# Altium schematic sheet TCA_LP_FILTER.SchDoc: My title
size A3; Organization: University of California; Address1: 475 Portola Plaza; Address2: Los Angeles, CA 90095; Revision: R01; SheetNumber: 1; SheetTotal: 1
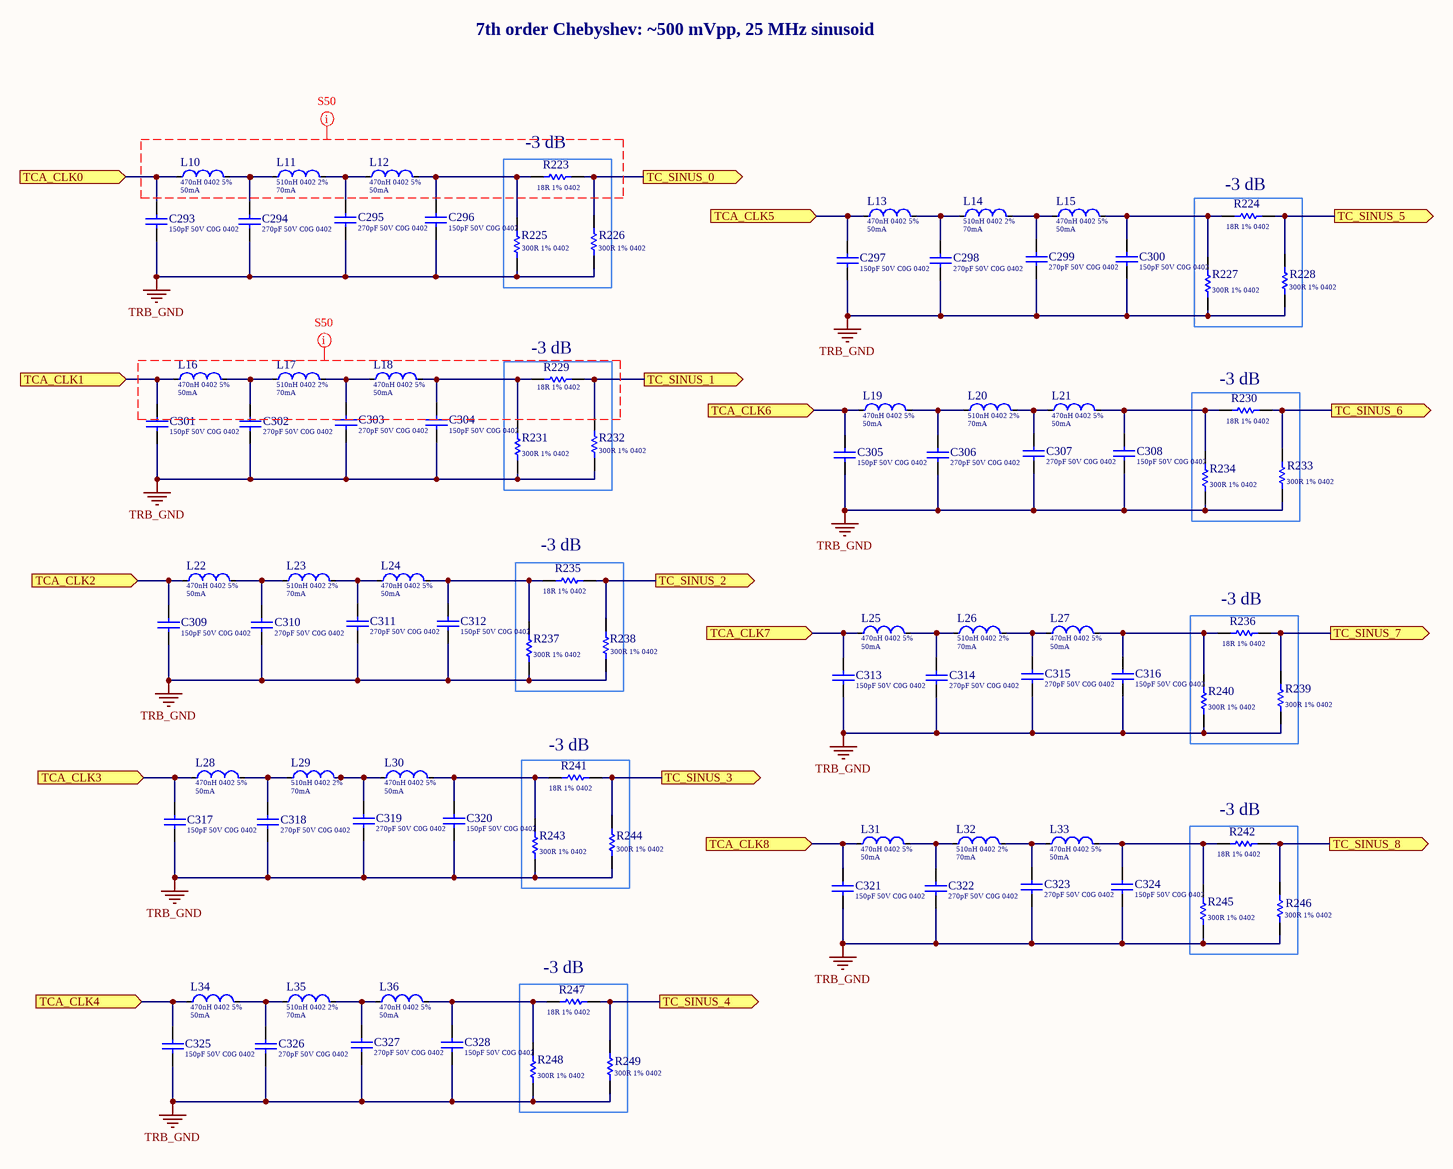
[diagram p0: TCA_LP_FILTER.SchDoc]

## Parts
C293  Capacitance: 150pF 50V C0G 0402  [Cap_TDK_CGA2B2C0G2A151J050BE_150pF]  (hidden comment: Cap_TDK_CGA2B2C0G2A151J050BE_150pF)
C294  Capacitance: 270pF 50V C0G 0402  [Cap_Murata_GCM1555C1H271FA16D_270pF]  (hidden comment: Cap_Murata_GCM1555C1H271FA16D_270pF)
C295  Capacitance: 270pF 50V C0G 0402  [Cap_Murata_GCM1555C1H271FA16D_270pF]  (hidden comment: Cap_Murata_GCM1555C1H271FA16D_270pF)
C296  Capacitance: 150pF 50V C0G 0402  [Cap_TDK_CGA2B2C0G2A151J050BE_150pF]  (hidden comment: Cap_TDK_CGA2B2C0G2A151J050BE_150pF)
C297  Capacitance: 150pF 50V C0G 0402  [Cap_TDK_CGA2B2C0G2A151J050BE_150pF]  (hidden comment: Cap_TDK_CGA2B2C0G2A151J050BE_150pF)
C298  Capacitance: 270pF 50V C0G 0402  [Cap_Murata_GCM1555C1H271FA16D_270pF]  (hidden comment: Cap_Murata_GCM1555C1H271FA16D_270pF)
C299  Capacitance: 270pF 50V C0G 0402  [Cap_Murata_GCM1555C1H271FA16D_270pF]  (hidden comment: Cap_Murata_GCM1555C1H271FA16D_270pF)
C300  Capacitance: 150pF 50V C0G 0402  [Cap_TDK_CGA2B2C0G2A151J050BE_150pF]  (hidden comment: Cap_TDK_CGA2B2C0G2A151J050BE_150pF)
C301  Capacitance: 150pF 50V C0G 0402  [Cap_TDK_CGA2B2C0G2A151J050BE_150pF]  (hidden comment: Cap_TDK_CGA2B2C0G2A151J050BE_150pF)
C302  Capacitance: 270pF 50V C0G 0402  [Cap_Murata_GCM1555C1H271FA16D_270pF]  (hidden comment: Cap_Murata_GCM1555C1H271FA16D_270pF)
C303  Capacitance: 270pF 50V C0G 0402  [Cap_Murata_GCM1555C1H271FA16D_270pF]  (hidden comment: Cap_Murata_GCM1555C1H271FA16D_270pF)
C304  Capacitance: 150pF 50V C0G 0402  [Cap_TDK_CGA2B2C0G2A151J050BE_150pF]  (hidden comment: Cap_TDK_CGA2B2C0G2A151J050BE_150pF)
C305  Capacitance: 150pF 50V C0G 0402  [Cap_TDK_CGA2B2C0G2A151J050BE_150pF]  (hidden comment: Cap_TDK_CGA2B2C0G2A151J050BE_150pF)
C306  Capacitance: 270pF 50V C0G 0402  [Cap_Murata_GCM1555C1H271FA16D_270pF]  (hidden comment: Cap_Murata_GCM1555C1H271FA16D_270pF)
C307  Capacitance: 270pF 50V C0G 0402  [Cap_Murata_GCM1555C1H271FA16D_270pF]  (hidden comment: Cap_Murata_GCM1555C1H271FA16D_270pF)
C308  Capacitance: 150pF 50V C0G 0402  [Cap_TDK_CGA2B2C0G2A151J050BE_150pF]  (hidden comment: Cap_TDK_CGA2B2C0G2A151J050BE_150pF)
C309  Capacitance: 150pF 50V C0G 0402  [Cap_TDK_CGA2B2C0G2A151J050BE_150pF]  (hidden comment: Cap_TDK_CGA2B2C0G2A151J050BE_150pF)
C310  Capacitance: 270pF 50V C0G 0402  [Cap_Murata_GCM1555C1H271FA16D_270pF]  (hidden comment: Cap_Murata_GCM1555C1H271FA16D_270pF)
C311  Capacitance: 270pF 50V C0G 0402  [Cap_Murata_GCM1555C1H271FA16D_270pF]  (hidden comment: Cap_Murata_GCM1555C1H271FA16D_270pF)
C312  Capacitance: 150pF 50V C0G 0402  [Cap_TDK_CGA2B2C0G2A151J050BE_150pF]  (hidden comment: Cap_TDK_CGA2B2C0G2A151J050BE_150pF)
C313  Capacitance: 150pF 50V C0G 0402  [Cap_TDK_CGA2B2C0G2A151J050BE_150pF]  (hidden comment: Cap_TDK_CGA2B2C0G2A151J050BE_150pF)
C314  Capacitance: 270pF 50V C0G 0402  [Cap_Murata_GCM1555C1H271FA16D_270pF]  (hidden comment: Cap_Murata_GCM1555C1H271FA16D_270pF)
C315  Capacitance: 270pF 50V C0G 0402  [Cap_Murata_GCM1555C1H271FA16D_270pF]  (hidden comment: Cap_Murata_GCM1555C1H271FA16D_270pF)
C316  Capacitance: 150pF 50V C0G 0402  [Cap_TDK_CGA2B2C0G2A151J050BE_150pF]  (hidden comment: Cap_TDK_CGA2B2C0G2A151J050BE_150pF)
C317  Capacitance: 150pF 50V C0G 0402  [Cap_TDK_CGA2B2C0G2A151J050BE_150pF]  (hidden comment: Cap_TDK_CGA2B2C0G2A151J050BE_150pF)
C318  Capacitance: 270pF 50V C0G 0402  [Cap_Murata_GCM1555C1H271FA16D_270pF]  (hidden comment: Cap_Murata_GCM1555C1H271FA16D_270pF)
C319  Capacitance: 270pF 50V C0G 0402  [Cap_Murata_GCM1555C1H271FA16D_270pF]  (hidden comment: Cap_Murata_GCM1555C1H271FA16D_270pF)
C320  Capacitance: 150pF 50V C0G 0402  [Cap_TDK_CGA2B2C0G2A151J050BE_150pF]  (hidden comment: Cap_TDK_CGA2B2C0G2A151J050BE_150pF)
C321  Capacitance: 150pF 50V C0G 0402  [Cap_TDK_CGA2B2C0G2A151J050BE_150pF]  (hidden comment: Cap_TDK_CGA2B2C0G2A151J050BE_150pF)
C322  Capacitance: 270pF 50V C0G 0402  [Cap_Murata_GCM1555C1H271FA16D_270pF]  (hidden comment: Cap_Murata_GCM1555C1H271FA16D_270pF)
C323  Capacitance: 270pF 50V C0G 0402  [Cap_Murata_GCM1555C1H271FA16D_270pF]  (hidden comment: Cap_Murata_GCM1555C1H271FA16D_270pF)
C324  Capacitance: 150pF 50V C0G 0402  [Cap_TDK_CGA2B2C0G2A151J050BE_150pF]  (hidden comment: Cap_TDK_CGA2B2C0G2A151J050BE_150pF)
C325  Capacitance: 150pF 50V C0G 0402  [Cap_TDK_CGA2B2C0G2A151J050BE_150pF]  (hidden comment: Cap_TDK_CGA2B2C0G2A151J050BE_150pF)
C326  Capacitance: 270pF 50V C0G 0402  [Cap_Murata_GCM1555C1H271FA16D_270pF]  (hidden comment: Cap_Murata_GCM1555C1H271FA16D_270pF)
C327  Capacitance: 270pF 50V C0G 0402  [Cap_Murata_GCM1555C1H271FA16D_270pF]  (hidden comment: Cap_Murata_GCM1555C1H271FA16D_270pF)
C328  Capacitance: 150pF 50V C0G 0402  [Cap_TDK_CGA2B2C0G2A151J050BE_150pF]  (hidden comment: Cap_TDK_CGA2B2C0G2A151J050BE_150pF)
L10  470nH 0402 5%  Current Rating: 50mA  [TDK_MLF1005GR47JT000_0]
L11  510nH 0402 2%  Current Rating: 70mA  [TDK_MHQ1005PR51GT000_0]
L12  470nH 0402 5%  Current Rating: 50mA  [TDK_MLF1005GR47JT000_0]
L13  470nH 0402 5%  Current Rating: 50mA  [TDK_MLF1005GR47JT000_0]
L14  510nH 0402 2%  Current Rating: 70mA  [TDK_MHQ1005PR51GT000_0]
L15  470nH 0402 5%  Current Rating: 50mA  [TDK_MLF1005GR47JT000_0]
L16  470nH 0402 5%  Current Rating: 50mA  [TDK_MLF1005GR47JT000_0]
L17  510nH 0402 2%  Current Rating: 70mA  [TDK_MHQ1005PR51GT000_0]
L18  470nH 0402 5%  Current Rating: 50mA  [TDK_MLF1005GR47JT000_0]
L19  470nH 0402 5%  Current Rating: 50mA  [TDK_MLF1005GR47JT000_0]
L20  510nH 0402 2%  Current Rating: 70mA  [TDK_MHQ1005PR51GT000_0]
L21  470nH 0402 5%  Current Rating: 50mA  [TDK_MLF1005GR47JT000_0]
L22  470nH 0402 5%  Current Rating: 50mA  [TDK_MLF1005GR47JT000_0]
L23  510nH 0402 2%  Current Rating: 70mA  [TDK_MHQ1005PR51GT000_0]
L24  470nH 0402 5%  Current Rating: 50mA  [TDK_MLF1005GR47JT000_0]
L25  470nH 0402 5%  Current Rating: 50mA  [TDK_MLF1005GR47JT000_0]
L26  510nH 0402 2%  Current Rating: 70mA  [TDK_MHQ1005PR51GT000_0]
L27  470nH 0402 5%  Current Rating: 50mA  [TDK_MLF1005GR47JT000_0]
L28  470nH 0402 5%  Current Rating: 50mA  [TDK_MLF1005GR47JT000_0]
L29  510nH 0402 2%  Current Rating: 70mA  [TDK_MHQ1005PR51GT000_0]
L30  470nH 0402 5%  Current Rating: 50mA  [TDK_MLF1005GR47JT000_0]
L31  470nH 0402 5%  Current Rating: 50mA  [TDK_MLF1005GR47JT000_0]
L32  510nH 0402 2%  Current Rating: 70mA  [TDK_MHQ1005PR51GT000_0]
L33  470nH 0402 5%  Current Rating: 50mA  [TDK_MLF1005GR47JT000_0]
L34  470nH 0402 5%  Current Rating: 50mA  [TDK_MLF1005GR47JT000_0]
L35  510nH 0402 2%  Current Rating: 70mA  [TDK_MHQ1005PR51GT000_0]
L36  470nH 0402 5%  Current Rating: 50mA  [TDK_MLF1005GR47JT000_0]
R223  18R 1% 0402  [RESC0402(1005)_L]
R224  18R 1% 0402  [RESC0402(1005)_L]
R225  300R 1% 0402  [RESC0402(1005)_L]
R226  300R 1% 0402  [RESC0402(1005)_L]
R227  300R 1% 0402  [RESC0402(1005)_L]
R228  300R 1% 0402  [RESC0402(1005)_L]
R229  18R 1% 0402  [RESC0402(1005)_L]
R230  18R 1% 0402  [RESC0402(1005)_L]
R231  300R 1% 0402  [RESC0402(1005)_L]
R232  300R 1% 0402  [RESC0402(1005)_L]
R233  300R 1% 0402  [RESC0402(1005)_L]
R234  300R 1% 0402  [RESC0402(1005)_L]
R235  18R 1% 0402  [RESC0402(1005)_L]
R236  18R 1% 0402  [RESC0402(1005)_L]
R237  300R 1% 0402  [RESC0402(1005)_L]
R238  300R 1% 0402  [RESC0402(1005)_L]
R239  300R 1% 0402  [RESC0402(1005)_L]
R240  300R 1% 0402  [RESC0402(1005)_L]
R241  18R 1% 0402  [RESC0402(1005)_L]
R242  18R 1% 0402  [RESC0402(1005)_L]
R243  300R 1% 0402  [RESC0402(1005)_L]
R244  300R 1% 0402  [RESC0402(1005)_L]
R245  300R 1% 0402  [RESC0402(1005)_L]
R246  300R 1% 0402  [RESC0402(1005)_L]
R247  18R 1% 0402  [RESC0402(1005)_L]
R248  300R 1% 0402  [RESC0402(1005)_L]
R249  300R 1% 0402  [RESC0402(1005)_L]

## Blocks framed on the sheet
-3 dB: R223 R225 R226
-3 dB: R224 R227 R228
-3 dB: R229 R231 R232
-3 dB: R230 R233 R234
-3 dB: R235 R237 R238
-3 dB: R236 R239 R240
-3 dB: R241 R243 R244
-3 dB: R242 R245 R246
-3 dB: R247-R249

## Ports
TC_SINUS_0 (out), TC_SINUS_1 (out), TC_SINUS_2 (out), TC_SINUS_3 (out), TC_SINUS_4 (out), TC_SINUS_5 (out), TC_SINUS_6 (out), TC_SINUS_7 (out), TC_SINUS_8 (out), TCA_CLK0 (in), TCA_CLK1 (in), TCA_CLK2 (in), TCA_CLK3 (in), TCA_CLK4 (in), TCA_CLK5 (in), TCA_CLK6 (in), TCA_CLK7 (in), TCA_CLK8 (in)

## Nets
TRB_GND: C293.1 C294.1 C295.1 C296.1 C297.1 C298.1 C299.1 C300.1 C301.1 C302.1 C303.1 C304.1 C305.1 C306.1 C307.1 C308.1 C309.1 C310.1 C311.1 C312.1 C313.1 C314.1 C315.1 C316.1 C317.1 C318.1 C319.1 C320.1 C321.1 C322.1 C323.1 C324.1 C325.1 C326.1 C327.1 C328.1 R225.1 R226.1 R227.1 R228.1 R231.1 R232.1 R233.1 R234.1 R237.1 R238.1 R239.1 R240.1 R243.1 R244.1 R245.1 R246.1 R248.1 R249.1
TC_SINUS_0: R223.2 R226.2 ; port TC_SINUS_0
TC_SINUS_1: R229.2 R232.2 ; port TC_SINUS_1
TC_SINUS_2: R235.2 R238.2 ; port TC_SINUS_2
TC_SINUS_3: R241.2 R244.2 ; port TC_SINUS_3
TC_SINUS_4: R247.2 R249.2 ; port TC_SINUS_4
TC_SINUS_5: R224.2 R228.2 ; port TC_SINUS_5
TC_SINUS_6: R230.2 R233.2 ; port TC_SINUS_6
TC_SINUS_7: R236.2 R239.2 ; port TC_SINUS_7
TC_SINUS_8: R242.2 R246.2 ; port TC_SINUS_8
TCA_CLK0: C293.2 L10.1 ; port TCA_CLK0
TCA_CLK1: C301.2 L16.1 ; port TCA_CLK1
TCA_CLK2: C309.2 L22.1 ; port TCA_CLK2
TCA_CLK3: C317.2 L28.1 ; port TCA_CLK3
TCA_CLK4: C325.2 L34.1 ; port TCA_CLK4
TCA_CLK5: C297.2 L13.1 ; port TCA_CLK5
TCA_CLK6: C305.2 L19.1 ; port TCA_CLK6
TCA_CLK7: C313.2 L25.1 ; port TCA_CLK7
TCA_CLK8: C321.2 L31.1 ; port TCA_CLK8
NetC294_2: C294.2 L10.2 L11.1
NetC295_2: C295.2 L11.2 L12.1
NetC296_2: C296.2 L12.2 R223.1 R225.2
NetC298_2: C298.2 L13.2 L14.1
NetC299_2: C299.2 L14.2 L15.1
NetC300_2: C300.2 L15.2 R224.1 R227.2
NetC302_2: C302.2 L16.2 L17.1
NetC303_2: C303.2 L17.2 L18.1
NetC304_2: C304.2 L18.2 R229.1 R231.2
NetC306_2: C306.2 L19.2 L20.1
NetC307_2: C307.2 L20.2 L21.1
NetC308_2: C308.2 L21.2 R230.1 R234.2
NetC310_2: C310.2 L22.2 L23.1
NetC311_2: C311.2 L23.2 L24.1
NetC312_2: C312.2 L24.2 R235.1 R237.2
NetC314_2: C314.2 L25.2 L26.1
NetC315_2: C315.2 L26.2 L27.1
NetC316_2: C316.2 L27.2 R236.1 R240.2
NetC318_2: C318.2 L28.2 L29.1
NetC319_2: C319.2 L29.2 L30.1
NetC320_2: C320.2 L30.2 R241.1 R243.2
NetC322_2: C322.2 L31.2 L32.1
NetC323_2: C323.2 L32.2 L33.1
NetC324_2: C324.2 L33.2 R242.1 R245.2
NetC326_2: C326.2 L34.2 L35.1
NetC327_2: C327.2 L35.2 L36.1
NetC328_2: C328.2 L36.2 R247.1 R248.2

## Layout directives
net class S50: (no net found under the mark)

## Notes on the sheet
- 7th order Chebyshev: ~500 mVpp, 25 MHz sinusoid
- 475 Portola Plaza
- GAPS TOF
- igarcia91@g.ucla.edu
- Los Angeles, CA
- 310-825-0344
- Size:
- Date:
- Letter
- Number:
- Time:
- Sheet
- Revision:
- of
- andrew.peck@cern.ch
- spq@ucla.edu
- File:

## Library data of the parts
C293 C296 C297 C300 C301 C304 C305 C308 C309 C312 C313 C316 C317 C320 C321 C324 C325 C328 = Cap_TDK_CGA2B2C0G2A151J050BE_150pF: CAP 150pF 50V C0G ±1% 0402 (1000 Metric) Thickness 1mm SMD; Supplier 1: Mouser; Supplier Part Number 1: 810-CGA2B2C0G2A151J0
C294 C295 C298 C299 C302 C303 C306 C307 C310 C311 C314 C315 C318 C319 C322 C323 C326 C327 = Cap_Murata_GCM1555C1H271FA16D_270pF: CAP 270pF 50V C0G ±1% 0402; Supplier 1: Mouser; Supplier Part Number 1: 81-GCM1555C1H271FA6D
L10 L12 L13 L15 L16 L18 L19 L21 L22 L24 L25 L27 L28 L30 L31 L33 L34 L36 = Ind_TDK_MLF1005GR47JT000: IND 470nH Shielded Multilayer Inductor 50mA 420 mOhm Max 0402 (1005 Metric); Manufacturer: TDK; Value: 270.0nH; DC Resistance (DCR): 420mOhms; Part Number: MLF1005GR47JT000; ComponentLink2Description: Datasheet; Temperature: -55°C to +125°C; ComponentLink2URL: https://product.tdk.com/info/en/catalog/datasheets/inductor_commercial_decoupling_mlz1608_en.pdf; RoHS: TRUE; Temperature Range High: +125°C; Lead Free: yes; Temperature Range Low: -55°C; Tolerance: ±5%; Package: 0402 (1005); Inductance: 470nH; Supplier 1: Mouser; Supplier Part Number 1: 810-MLF1005GR47JT000
L11 L14 L17 L20 L23 L26 L29 L32 L35 = Ind_TDK_MHQ1005PR51GT000: IND 510nH Shielded Multilayer Inductor 70mA 10.2 Ohm Max 0402 (1005 Metric); Manufacturer: TDK; Value: 510.0nH; DC Resistance (DCR): 10.2Ohms; Part Number: MHQ1005PR51GT000; ComponentLink2Description: Datasheet; Temperature: -55°C to +125°C; ComponentLink2URL: https://product.tdk.com/info/en/catalog/datasheets/inductor_commercial_decoupling_mlz1608_en.pdf; RoHS: TRUE; Temperature Range High: +125°C; Lead Free: yes; Temperature Range Low: -55°C; Tolerance: ±2%; Package: 0402 (1005); Inductance: 510nH; Supplier Part Number 1: 810-MHQ1005PR51GT000; Supplier 1: Mouser
R223 R224 R229 R230 R235 R236 R241 R242 R247 = CMP-1011-00311-1: 18R 0.063W 1% 0402 (1005 Metric)  SMD; Case-EIA: 0402; Value: 18.00 Ohm; Case-Metric: 1005; Tolerance: 1 %; Power: 0.063 W; Technology: SMT
R225-R228 R231-R234 R237-R240 R243-R246 R248 R249 = CMP-1011-00449-1: 300R 0.063W 1% 0402 (1005 Metric)  SMD; Case-EIA: 0402; Value: 300.00 Ohm; Case-Metric: 1005; Tolerance: 1 %; Technology: SMT; Power: 0.063 W